# Altium schematic sheet Filter.SchDoc
size A3
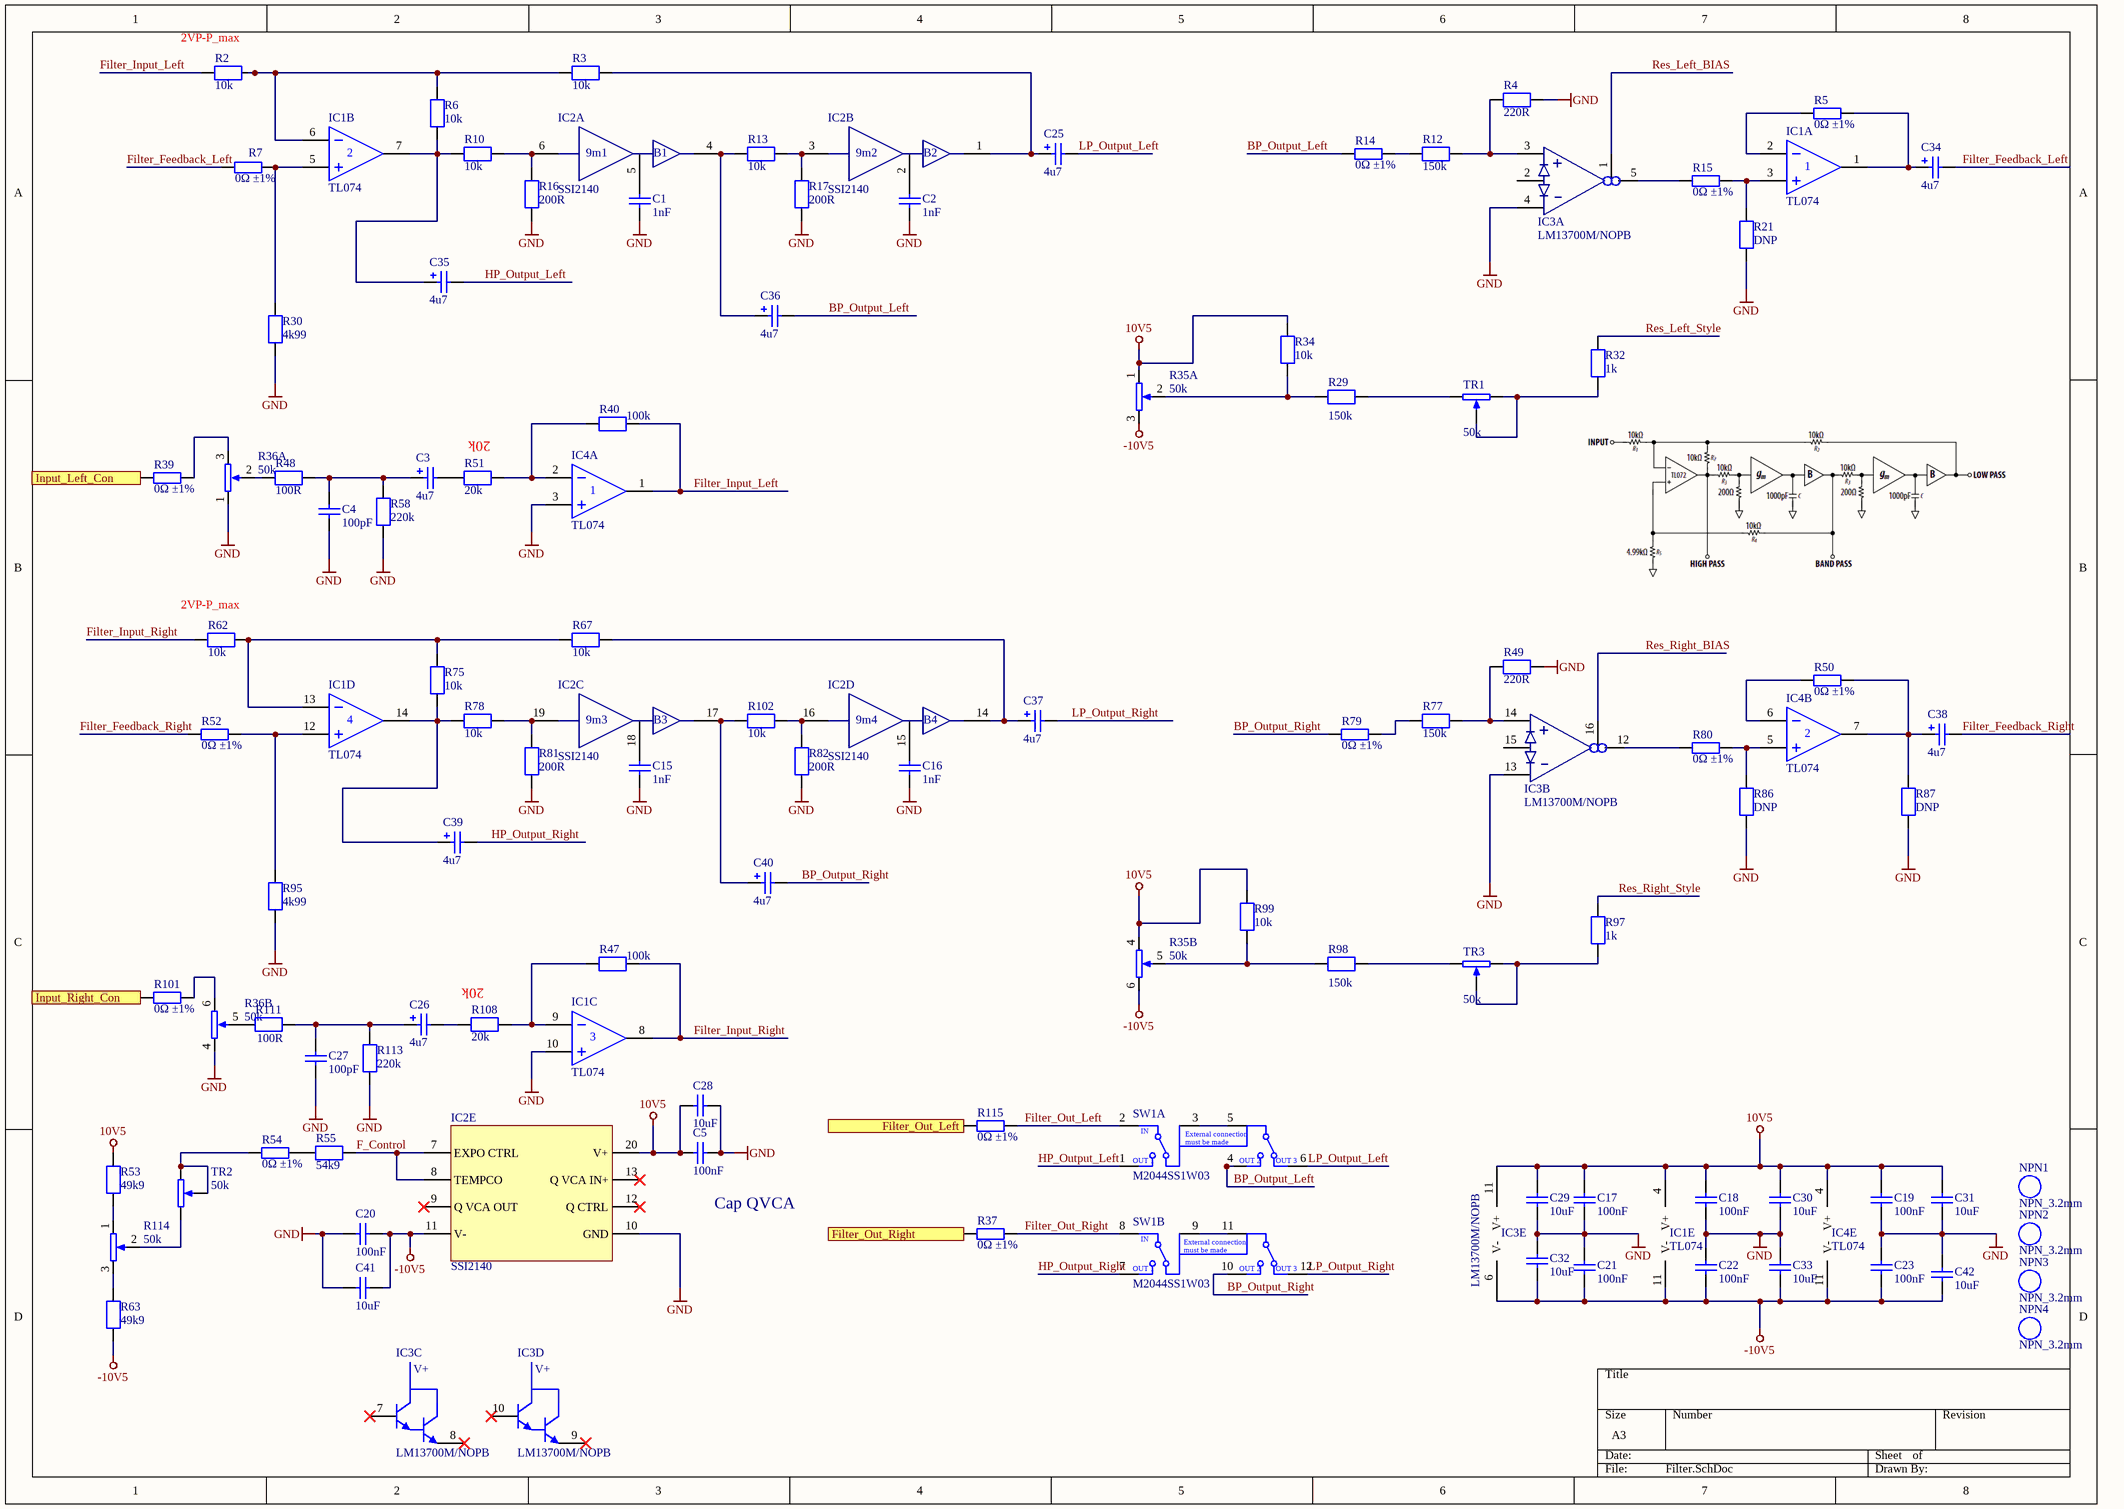
[diagram p0: Filter.SchDoc]

## Parts
C1  1nF  [CAPC2012X145N]  (no BOM)
C2  1nF  [CAPC2012X145N]  (no BOM)
C3  4u7  [CAPAE4643X54M]
C4  100pF  [CAPC2012X145N]
C5  100nF  [CAPC1608X95N]
C15  1nF  [CAPC2012X145N]  (no BOM)
C16  1nF  [CAPC2012X145N]  (no BOM)
C17  100nF  [CAPC1608X95N]
C18  100nF  [CAPC1608X95N]
C19  100nF  [CAPC1608X95N]
C20  100nF  [CAPC1608X95N]
C21  100nF  [CAPC1608X95N]
C22  100nF  [CAPC1608X95N]
C23  100nF  [CAPC1608X95N]
C25  4u7  [CAPAE4643X54M]
C26  4u7  [CAPAE4643X54M]
C27  100pF  [CAPC2012X145N]
C28  10uF  [CAPC2012X145N]
C29  10uF  [CAPC2012X145N]
C30  10uF  [CAPC2012X145N]
C31  10uF  [CAPC2012X145N]
C32  10uF  [CAPC2012X145N]
C33  10uF  [CAPC2012X145N]
C34  4u7  [CAPAE4643X54M]
C35  4u7  [CAPAE4643X54M]
C36  4u7  [CAPAE4643X54M]
C37  4u7  [CAPAE4643X54M]
C38  4u7  [CAPAE4643X54M]
C39  4u7  [CAPAE4643X54M]
C40  4u7  [CAPAE4643X54M]
C41  10uF  [CAPC2012X145N]
C42  10uF  [CAPC2012X145N]
IC1  TL074  [SOIC127P600X175-14N]  (parts A,B,C,D,E of 5)
IC2  SSI2140  [SOP65P650-20N]  (parts A,B,C,D,E of 5)
IC3  LM13700M/NOPB  [SOP127P600X175-16N]  (parts A,B,C,D,E of 5)
IC4  TL074  [SOIC127P600X175-14N]  (parts A,B,E of 5)
NPN1  NPN_3.2mm  [HOLE_NPH_3.2_M3]
NPN2  NPN_3.2mm  [HOLE_NPH_3.2_M3]
NPN3  NPN_3.2mm  [HOLE_NPH_3.2_M3]
NPN4  NPN_3.2mm  [HOLE_NPH_3.2_M3]
R2  10k  [RESC2012X70N]
R3  10k  [RESC2012X70N]
R4  220R  [RESC2012X70N]
R5  0Ω ±1%  [RESC2012X70N]
R6  10k  [RESC2012X70N]
R7  0Ω ±1%  [RESC2012X70N]
R10  10k  [RESC2012X70N]
R12  150k  [RESC2012X70N]
R13  10k  [RESC2012X70N]
R14  0Ω ±1%  [RESC2012X70N]
R15  0Ω ±1%  [RESC2012X70N]
R16  200R  [RESC2012X70N]
R17  200R  [RESC2012X70N]
R21  DNP  [RESC2012X70N]  (no BOM)
R29  150k  [RESC2012X70N]
R30  4k99  [RESC2012X70N]
R32  1k  [RESC2012X70N]
R34  10k  [RESC2012X70N]
R35  50k  [RK09L2]  (parts A,B of 2)
R36  50k  [RK09L2]  (parts A,B of 2)
R37  0Ω ±1%  [RESC2012X70N]
R39  0Ω ±1%  [RESC2012X70N]
R40  100k  [RESC2012X70N]
R47  100k  [RESC2012X70N]
R48  100R  [RESC2012X70N]
R49  220R  [RESC2012X70N]
R50  0Ω ±1%  [RESC2012X70N]
R51  20k  [RESC2012X70N]
R52  0Ω ±1%  [RESC2012X70N]
R53  49k9  [RESC2012X70N]
R54  0Ω ±1%  [RESC2012X70N]
R55  54k9  [RESC2012X70N]
R58  220k  [RESC2012X70N]
R62  10k  [RESC2012X70N]
R63  49k9  [RESC2012X70N]
R67  10k  [RESC2012X70N]
R75  10k  [RESC2012X70N]
R77  150k  [RESC2012X70N]
R78  10k  [RESC2012X70N]
R79  0Ω ±1%  [RESC2012X70N]
R80  0Ω ±1%  [RESC2012X70N]
R81  200R  [RESC2012X70N]
R82  200R  [RESC2012X70N]
R86  DNP  [RESC2012X70N]  (no BOM)
R87  DNP  [RESC2012X70N]  (no BOM)
R95  4k99  [RESC2012X70N]
R97  1k  [RESC2012X70N]
R98  150k  [RESC2012X70N]
R99  10k  [RESC2012X70N]
R101  0Ω ±1%  [RESC2012X70N]
R102  10k  [RESC2012X70N]
R108  20k  [RESC2012X70N]
R111  100R  [RESC2012X70N]
R113  220k  [RESC2012X70N]
R114  50k  [RK09L1]
R115  0Ω ±1%  [RESC2012X70N]
SW1  M2044SS1W03  [M2044SS1W03]  (parts A,B of 2)
TR1  50k  [PVG3G503C01R00]
TR2  50k  [PVG3G503C01R00]
TR3  50k  [PVG3G503C01R00]

## Ports
Filter_Out_Left, Filter_Out_Right, Input_Left_Con, Input_Right_Con

## Nets
10V5: C5.1 C17.2 C18.2 C19.2 C28.2 C29.2 C30.2 C31.2 IC1.4(V+) IC2.20(V+) IC3.11(V+) IC4.4(V+) R34.2 R35.1 R35.4 R53.2 R99.2
-10V5: C20.2 C21.1 C22.1 C23.1 C32.1 C33.1 C41.1 C42.1 IC1.11(V-) IC2.11(V-) IC3.6(V-) IC4.11(V-) R35.3 R35.6 R63.1
GND: C1.1 C2.1 C4.1 C5.2 C15.1 C16.1 C17.1 C18.1 C19.1 C20.1 C21.2 C22.2 C23.2 C27.1 C28.1 C29.1 C30.1 C31.1 C32.2 C33.2 C41.2 C42.2 IC1.10(IN-) IC2.10(GND) IC3.4(Input_1_-) IC3.13(Input_2_-) IC4.3(IN+) R4.2 R16.1 R17.1 R21.1 R30.1 R36.1 R36.4 R49.2 R58.1 R81.1 R82.1 R86.1 R87.1 R95.1 R113.1
BP_Output_Left: C36.2 R14.1 SW1.4
BP_Output_Right: C40.2 R79.1 SW1.10
F_Control: IC2.7(EXPO_CTRL) IC2.8(TEMPCO) R55.2
Filter_Feedback_Left: C34.2 R7.1
Filter_Feedback_Right: C38.2 R52.1
Filter_Input_Left: IC4.1(OUT) R2.1 R40.2
Filter_Input_Right: IC1.8(OUT) R47.2 R62.2
Filter_Out_Left: R115.2 ; port Filter_Out_Left
Filter_Out_Left: R115.1 SW1.2  [a separate net that carries the same name]
Filter_Out_Right: R37.2 SW1.8
Filter_Out_Right: R37.1 ; port Filter_Out_Right  [a separate net that carries the same name]
HP_Output_Left: C35.2 SW1.1
HP_Output_Right: C39.2 SW1.7
Input_Left_Con: R39.1 ; port Input_Left_Con
Input_Right_Con: R101.1 ; port Input_Right_Con
LP_Output_Left: C25.2 SW1.6
LP_Output_Right: C37.2 SW1.12
Res_Left_BIAS: IC3.1(Bias_In_1)
Res_Left_Style: R32.2
Res_Right_BIAS: IC3.16(Bias_In_2)
Res_Right_Style: R97.2
NetC1_2: C1.2 IC2.5(CAP_1)
NetC2_2: C2.2 IC2.2(CAP_2)
NetC3_1: C3.1 C4.2 R48.2 R58.2
NetC3_2: C3.2 R51.1
NetC15_2: C15.2 IC2.18(CAP_3)
NetC16_2: C16.2 IC2.15(CAP_4)
NetC25_1: C25.1 IC2.1(OUT_2) R3.2
NetC26_1: C26.1 C27.2 R111.2 R113.2
NetC26_2: C26.2 R108.1
NetC34_1: C34.1 IC1.1(OUT) R5.2
NetC35_1: C35.1 IC1.7(OUT) R6.1 R10.1
NetC36_1: C36.1 IC2.4(OUT_1) R13.1
NetC37_1: C37.1 IC2.14(OUT_4) R67.2
NetC38_1: C38.1 IC4.7(OUT) R50.2 R87.2
NetC39_1: C39.1 IC1.14(OUT) R75.1 R78.1
NetC40_1: C40.1 IC2.17(OUT_3) R102.1
NetIC1_2: IC1.2(IN-) R5.1
NetIC1_3: IC1.3(IN+) R15.2 R21.2
NetIC1_5: IC1.5(IN+) R7.2 R30.2
NetIC1_6: IC1.6(IN-) R2.2 R3.1 R6.2
NetIC1_9: IC1.9(IN+) R47.1 R108.2
NetIC1_12: IC1.12(IN+) R52.2 R95.2
NetIC1_13: IC1.13(IN-) R62.1 R67.1 R75.2
NetIC2_3: IC2.3(IN_2) R13.2 R17.2
NetIC2_6: IC2.6(IN_1) R10.2 R16.2
NetIC2_16: IC2.16(IN_4) R82.2 R102.2
NetIC2_19: IC2.19(IN_3) R78.2 R81.2
NetIC3_3: IC3.3(Input_1_+) R4.1 R12.2
NetIC3_5: IC3.5(Output_1) R15.1
NetIC3_12: IC3.12(Output_2) R80.1
NetIC3_14: IC3.14(Input_2_+) R49.1 R77.2
NetIC4_2: IC4.2(IN-) R40.1 R51.2
NetIC4_5: IC4.5(IN+) R80.2 R86.2
NetIC4_6: IC4.6(IN-) R50.1
NetR12_1: R12.1 R14.2
NetR29_1: R29.1 R34.1 R35.2
NetR29_2: R29.2 TR1.1
NetR32_1: R32.1 TR1.2 TR1.3
NetR35_5: R35.5 R98.1 R99.1
NetR36_2: R36.2 R48.1
NetR36_3: R36.3 R39.2
NetR36_5: R36.5 R111.1
NetR36_6: R36.6 R101.2
NetR53_1: R53.1 R114.1
NetR54_1: R54.1 TR2.2 TR2.3
NetR54_2: R54.2 R55.1
NetR63_2: R63.2 R114.3
NetR77_1: R77.1 R79.2
NetR97_1: R97.1 TR3.2 TR3.3
NetR98_2: R98.2 TR3.1
NetR114_2: R114.2 TR2.1
NetSW1_3: SW1.3 SW1.5
NetSW1_9: SW1.9 SW1.11

Not connected (* = marked no-connect by the designer): IC2 9(Q_VCA_OUT)* 12(Q_CTRL)* 13(Q_VCA_IN+)*; IC3 2(BIAS) 7(Buffer_In_1)* 8(Buffer_Out_1)* 9(Buffer_Out_2)* 10(Buffer_In_2)* 15(BIAS)

## Notes on the sheet
- (near R2) 2VP-P_max
- 20k
- (near R62) 2VP-P_max
- (near C5) Cap QVCA
- (in symbol IC_SSI2140, part A) 9m1; B1
- (in symbol IC_SSI2140, part B) 9m2; B2
- (in symbol IC_SSI2140, part C) 9m3; B3
- (in symbol IC_SSI2140, part D) 9m4; B4
- (in symbol M2044SS1W03, part A) IN; External connection must be made; OUT 1; OUT 2; OUT 3
- (in symbol M2044SS1W03, part B) IN; External connection must be made; OUT 1; OUT 2; OUT 3

## Library data of the parts
C1 C15 = CAP_1nF_630V: Multilayer Ceramic Capacitors MLCC - SMD/SMT, C0G(NP0), 100nF; Manufacturer: Murata Electronics; Manufacturer Part Number: GRM21B5C2J102JWA3L; Voltage Rating: 630VDC; Tolerance: 5%; Alternatives allowed: yes
C2 C16 = CAP_100nF_630V: Multilayer Ceramic Capacitors MLCC - SMD/SMT, C0G(NP0), 1nF; Manufacturer: Murata Electronics; Manufacturer Part Number: GRM21B5C2J102JWA3L; Voltage Rating: 630VDC; Tolerance: 5%; Alternatives allowed: yes
C3 C25 C26 C34-C40 = CAP_4u7: Aluminium Electrolytic Capacitors - SMD 4.7UF 16V ELECT VS BI-POLAR; Manufacturer: Panasonic; Manufacturer Part Number: EEE-1CA4R7NR; Tolerance: 20%; Alternatives allowed: NO; Voltage Rating: 16V
C4 C27 = CAP_100pF_0805: Film Capacitors 100pF 50VDC 2% PPS FILM 0805; Manufacturer: Panasonic; Manufacturer Part Number: ECH-U1H101GX5; Voltage Rating: 50V; Alternatives allowed: NO; Tolerance: 2%
C5 C17-C23 = CAP_100nF_0603: Multilayer Ceramic Capacitors MLCC - SMD/SMT, 100nF; Manufacturer: YAGEO; Manufacturer Part Number: CC0603KRX7R9BB104; Voltage Rating: 50VDC; Tolerance: 10%; Alternatives allowed: yes; JLC: C14663
C28-C33 C41 C42 = CAP_10uF_0805: Multilayer Ceramic Capacitors MLCC - SMD/SMT, 10uF; Manufacturer: Samsung Electro-Mechanics; Manufacturer Part Number: CL21A106KAYNNNE; Voltage Rating: 25V; Tolerance: 10%; Alternatives allowed: yes; JLC: C15850
IC1 IC4 = IC_TL074: Operational Amplifiers - Op Amps Dual JFET Op Amp; Manufacturer: Texas Instruments; Manufacturer Part Number: TL074CDR; Alternatives allowed: NO
IC2 = IC_SSI2140: Voltage Controlled Multi-Mode Filter; Manufacturer: Sound Semiconductor; Alternatives allowed: NO; Manufacturer Part Number: SSI2140; JLC: *
IC3 = IC_LM13700: Transconductance Amplifiers DUAL OP TRANSCOND; Manufacturer: Texas Instruments; Alternatives allowed: NO; Manufacturer Part Number: LM13700M/NOPB; JLC: *
NPN1-NPN4 = NPH_3.2mm_M3
R2 R3 R6 R10 R13 R34 R62 R67 R75 R78 R99 R102 = RES_10k_0805: Thick Film Resistors - SMD 1/8watt 10Kohms 1% 100ppm; Manufacturer: Vishay / Dale; Manufacturer Part Number: CRCW080510K0FKEA; Voltage Rating: 150V; Alternatives allowed: YES; Tolerance: 1%; JLC: C17414
R4 R49 = RES_220R_0805: Dickfilmwiderstände - SMD 1/8watt 220ohms 1% 100ppm /; Manufacturer: Vishay / Dale; Manufacturer Part Number: CRCW0805220RFKEA; Voltage Rating: 150V; Alternatives allowed: YES; Tolerance: 1%; JLC: C17557
R5 R7 R14 R15 R37 R39 R50 R52 R54 R79 R80 R101 R115 = 0805 0R (0R0) 1%: Chip resistor; Manufacturer Part Number: CRCW08050000Z0EAC; Manufacturer: Vishay / Dale; Alternatives allowed: YES; Tolerance: 1%; JLC: C17477
R12 R29 R77 R98 = RES_150k_0805: Thick Film Resistors - SMD 1/8watt 150Kohms 1% 100ppm; Manufacturer: Vishay / Dale; Manufacturer Part Number: CRCW0805150KFKEA; Voltage Rating: 150V; Alternatives allowed: YES; Tolerance: 1%; JLC: C17470
R16 R17 R81 R82 = RES_200R_0805: Thick Film Resistors - SMD 1/8watt 200ohms 1% 100ppm; Manufacturer: Vishay / Dale; Manufacturer Part Number: CRCW0805200RFKEA; Voltage Rating: 150V; Alternatives allowed: YES; Tolerance: 1%; JLC: C17540
R21 R86 R87 = RES_DNF_0805: Resistor SMD 0805 - not populated; Notes: Not populated
R30 R95 = RES_4k99_0805: Thick Film Resistors - SMD 1/8watt 4.99Kohms 1% 100ppm; Manufacturer: Vishay / Dale; Manufacturer Part Number: CRCW08054K99FKEA; Voltage Rating: 150V; Alternatives allowed: YES; Tolerance: 1%; JLC: C17677
R32 R97 = RES_1k_0805: Thick Film Resistors - SMD 1/8watt 1Kohms 1% 100ppm; Manufacturer: Vishay / Dale; Manufacturer Part Number: CRCW08051K00FKEA; Voltage Rating: 150V; Alternatives allowed: YES; Tolerance: 1%; JLC: C17513
R35 R36 = POT_50k_lin_dual: Potentiometers 50K VERTICAL dual; Manufacturer: Alps Alpine; Manufacturer Part Number: RK09L124000Z; Tolerance: 20%
R40 R47 = RES_100k_0805: Thick Film Resistors - SMD 1/8watt 100Kohms 1% 100ppm; Manufacturer: Vishay / Dale; Manufacturer Part Number: CRCW0805100KFKEA; Voltage Rating: 150V; Alternatives allowed: YES; Tolerance: 1%; JLC: C17407
R48 R111 = RES_100R_0805: Thick Film Resistors 1/8watt 100ohms 1% 100ppm; Manufacturer: Vishay / Dale; Manufacturer Part Number: CRCW0805100RFKEA; Voltage Rating: 150V; Alternatives allowed: YES; Tolerance: 1%; JLC: C17408
R51 R108 = RES_20k_0805: Thick Film Resistors - SMD 1/8watt 20Kohms 1% 100ppm; Manufacturer: Vishay / Dale; Manufacturer Part Number: CRCW080520K0FKEA; Voltage Rating: 150V; Alternatives allowed: YES; Tolerance: 1%; JLC: C4328
R53 R63 = RES_49k9_0805: Thick Film Resistors - SMD 1/8watt 49.9Kohms 1% 100ppm; Manufacturer: Vishay / Dale; Manufacturer Part Number: CRCW080549K9FKEA; Voltage Rating: 150V; Alternatives allowed: YES; Tolerance: 1%; JLC: C17719
R55 = RES_54k9_0805: Thick Film Resistors - SMD 1/8watt 54.9Kohms 1% 100ppm; Manufacturer: Vishay / Dale; Manufacturer Part Number: CRCW080554K9FKEA; Voltage Rating: 150V; Alternatives allowed: YES; Tolerance: 1%
R58 R113 = RES_220k_0805: Thick Film Resistors - SMD 1/8watt 220Kohms 1%; Manufacturer: Vishay / Dale; Manufacturer Part Number: CRCW0805220KFKEA; Voltage Rating: 150V; Alternatives allowed: YES; Tolerance: 1%; JLC: C17556
R114 = POT_50k_lin: Potentiometers 50K VERTICAL; Manufacturer: Alps Alpine; Manufacturer Part Number: RK09L1140A5P; Tolerance: 20%
SW1 = M2044SS1W03: Kippschalter DP3T Panelmontage; Manufacturer: NKK Switches; Alternatives allowed: NO; Manufacturer Part Number: M2044SS1W03
TR1-TR3 = TRIM_50k_lin: Trimmer Resistors - SMD 50K Ohm 20% 1/4W; Manufacturer: Bourns; Manufacturer Part Number: PVG3G503C01R00; Tolerance: 20%